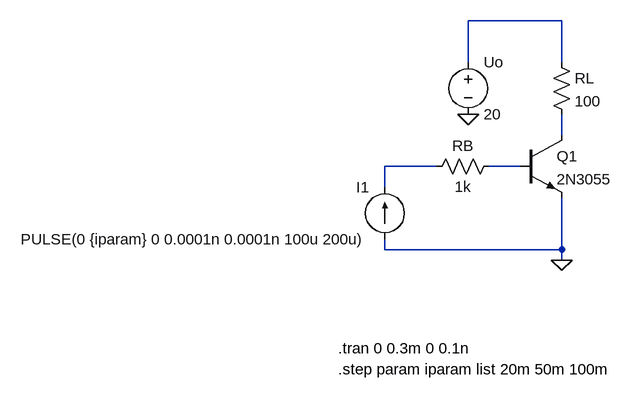
[diagram p0: schematic SimulationSchaltzeiten.asc]
SimulationSchaltzeiten.asc, the LTspice schematic file:
Version 4.1
SHEET 1 880 680
WIRE 128 -80 -16 -80
WIRE -16 -16 -16 -80
WIRE 128 -16 128 -80
WIRE 128 96 128 64
WIRE -64 144 -144 144
WIRE 64 144 16 144
WIRE -144 176 -144 144
WIRE -144 272 -144 256
WIRE 128 272 128 192
WIRE 128 272 -144 272
WIRE 128 288 128 272
FLAG -16 64 0
FLAG 128 288 0
SYMBOL npn 64 96 R0
SYMATTR InstName Q1
SYMATTR Value 2N3055
SYMBOL voltage -16 -32 R0
WINDOW 123 0 0 Left 0
WINDOW 39 0 0 Left 0
SYMATTR InstName Uo
SYMATTR Value 20
SYMBOL res 112 -32 R0
SYMATTR InstName RL
SYMATTR Value 100
SYMBOL res 32 128 R90
WINDOW 0 0 56 VBottom 2
WINDOW 3 32 56 VTop 2
SYMATTR InstName RB
SYMATTR Value 1k
SYMBOL current -144 256 R180
WINDOW 0 24 80 Left 2
WINDOW 3 24 0 Left 2
SYMATTR InstName I1
SYMATTR Value PULSE(0 {iparam} 0 0.0001n 0.0001n 100u 200u)
TEXT -216 424 Left 2 !.tran 0 0.3m 0 0.1n
TEXT -216 456 Left 2 !.step param iparam list 20m 50m 100m

The netlist it stands for:
* SimulationSchaltzeiten.asc
Q1 N002 N004 0 0 2N3055
V§Uo N001 0 20
RL N001 N002 100
RB N004 N003 1k
I1 0 N003 PULSE(0 {iparam} 0 0.0001n 0.0001n 100u 200u)
.model NPN NPN
.model PNP PNP
.lib standard.bjt
.tran 0 0.3m 0 0.1n
.step param iparam list 20m 50m 100m
.backanno
.end